# EAGLE design Caja_Navidad (EAGLE 9.6.2)
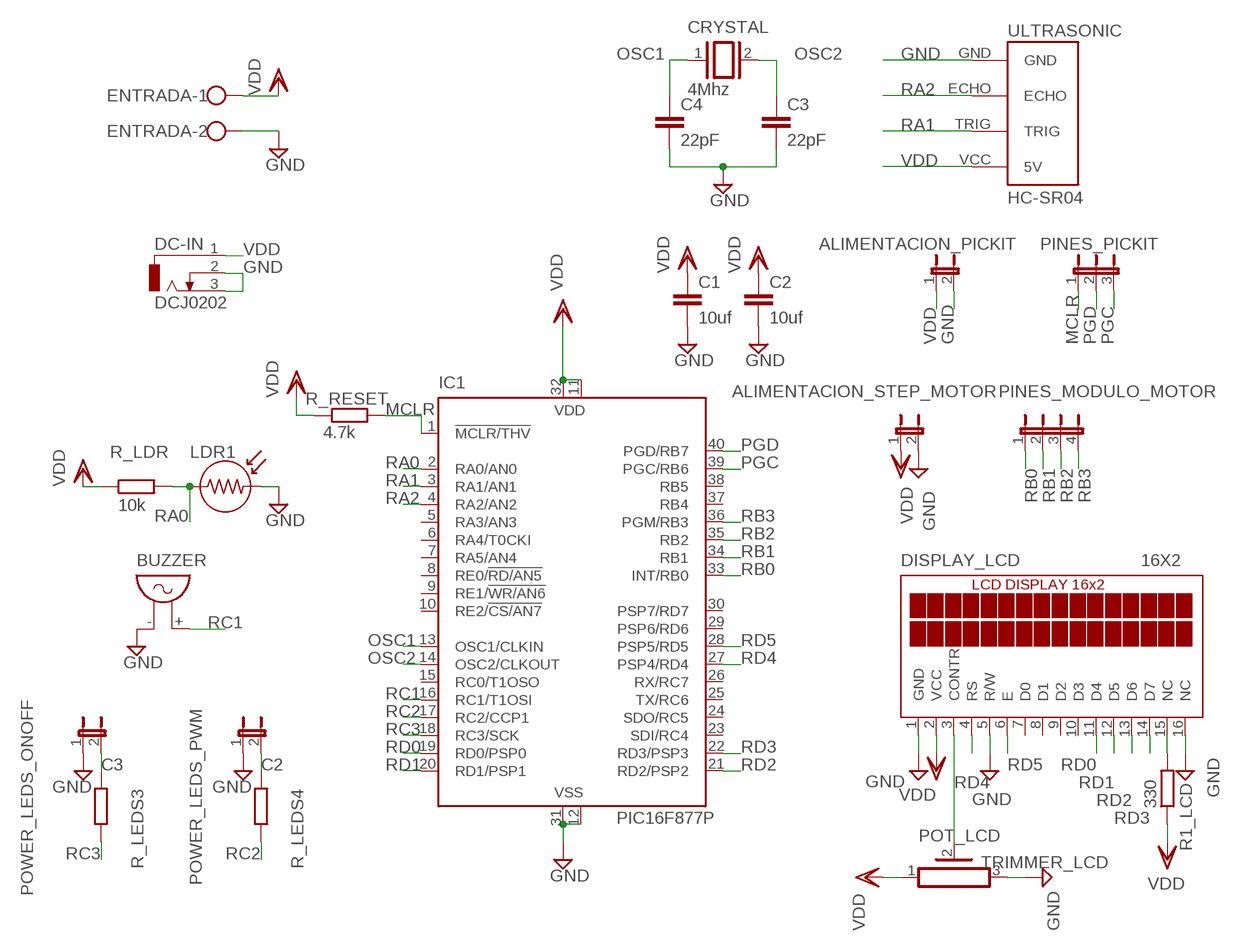
[diagram p0: schematic, sheet 1]

## Parts
ALIMENTACION_PICKIT  JP1E  [JP1]
ALIMENTACION_STEP_MOTOR  JP1E  [JP1]
BUZZER  F/QMX  [F/QMX]
C1  10uf  C2.5/2  [C2.5-2]
C2  10uf  C2.5/2  [C2.5-2]
C3  22pF  C2.5/2  [C2.5-2]
C4  22pF  C2.5/2  [C2.5-2]
CRYSTAL  4Mhz  XTAL  [Q]
DC-IN  DCJ0202  [DCJ0202]
DISPLAY_LCD  16X2  TUXGR_16X2_R2  [TUXGR_16X2_R2]
ENTRADA  W237-102  [W237-102]
IC1  PIC16F877P  [DIL40]
LDR1  LDR  [LDR]
PINES_MODULO_MOTOR  JP4E  [JP4]
PINES_PICKIT  JP2E  [JP2]
POWER_LEDS_ONOFF  JP1E  [JP1]
POWER_LEDS_PWM  JP1E  [JP1]
R1_LCD  330  R-EU_0204/7  [0204/7]
R_LDR  10k  R-EU_0204/7  [0204/7]
R_LEDS3  330  R-EU_0204/7  [0204/7]
R_LEDS4  R-EU_0204/7  [0204/7]
R_RESET  4.7k  R-EU_0204/7  [0204/7]
TRIMMER_LCD  PV36W  [PV36W]
ULTRASONIC  HC-SR04  [HC-SR04_FOOTPRINT]

## Nets
C2: POWER_LEDS_PWM.2 R_LEDS4.2
C3: POWER_LEDS_ONOFF.2 R_LEDS3.2
GND: ALIMENTACION_PICKIT.2 ALIMENTACION_STEP_MOTOR.2 BUZZER.- C1.2 C2.2 C3.2 C4.2 DC-IN.2 DC-IN.3 DISPLAY_LCD.1(GND) DISPLAY_LCD.5(R/W) DISPLAY_LCD.16(NC) ENTRADA.2 IC1.12(VSS) IC1.31(VSS) LDR1.2 POWER_LEDS_ONOFF.1 POWER_LEDS_PWM.1 TRIMMER_LCD.3 ULTRASONIC.GND
MCLR: IC1.1(!MCLR/THV) PINES_PICKIT.1 R_RESET.2
N$2: DISPLAY_LCD.15(NC) R1_LCD.2
OSC1: C4.1 CRYSTAL.1 IC1.13(OSC1/CLKIN)
OSC2: C3.1 CRYSTAL.2 IC1.14(OSC2/CLKOUT)
PGC: IC1.39(PGC/RB6) PINES_PICKIT.3
PGD: IC1.40(PGD/RB7) PINES_PICKIT.2
POT_LCD: DISPLAY_LCD.3(CONTR) TRIMMER_LCD.2
RA0: IC1.2(RA0/AN0) LDR1.1 R_LDR.2
RA1: IC1.3(RA1/AN1) ULTRASONIC.TRIG
RA2: IC1.4(RA2/AN2) ULTRASONIC.ECHO
RB0: IC1.33(INT/RB0) PINES_MODULO_MOTOR.1
RB1: IC1.34(RB1) PINES_MODULO_MOTOR.2
RB2: IC1.35(RB2) PINES_MODULO_MOTOR.3
RB3: IC1.36(PGM/RB3) PINES_MODULO_MOTOR.4
RC1: BUZZER.+ IC1.16(RC1/T1OSI)
RC2: IC1.17(RC2/CCP1) R_LEDS4.1
RC3: IC1.18(RC3/SCK) R_LEDS3.1
RD0: DISPLAY_LCD.11(D4) IC1.19(RD0/PSP0)
RD1: DISPLAY_LCD.12(D5) IC1.20(RD1/PSP1)
RD2: DISPLAY_LCD.13(D6) IC1.21(RD2/PSP2)
RD3: DISPLAY_LCD.14(D7) IC1.22(RD3/PSP3)
RD4: DISPLAY_LCD.4(RS) IC1.27(PSP4/RD4)
RD5: DISPLAY_LCD.6(E) IC1.28(PSP5/RD5)
VDD: ALIMENTACION_PICKIT.1 ALIMENTACION_STEP_MOTOR.1 C1.1 C2.1 DC-IN.1 DISPLAY_LCD.2(VCC) ENTRADA.1 IC1.11(VDD) IC1.32(VDD) R1_LCD.1 R_LDR.1 R_RESET.1 TRIMMER_LCD.1 ULTRASONIC.VCC(5V)
Unconnected: DISPLAY_LCD.7(D0) DISPLAY_LCD.8(D1) DISPLAY_LCD.9(D2) DISPLAY_LCD.10(D3) IC1.5(RA3/AN3) IC1.6(RA4/T0CKI) IC1.7(RA5/AN4) IC1.8(RE0/!RD/AN5) IC1.9(RE1/!WR/AN6) IC1.10(RE2/!CS/AN7) IC1.15(RC0/T1OSO) IC1.23(SDI/RC4) IC1.24(SDO/RC5) IC1.25(TX/RC6) IC1.26(RX/RC7) IC1.29(PSP6/RD6) IC1.30(PSP7/RD7) IC1.37(RB4) IC1.38(RB5)

## Library data of the parts
ALIMENTACION_PICKIT ALIMENTACION_STEP_MOTOR POWER_LEDS_ONOFF POWER_LEDS_PWM = jumper:JP1E: JUMPER
BUZZER = buzzer:F/QMX: BUZZER Source: Buerklin; OC_FARNELL: unknown; OC_NEWARK: unknown
C1-C4 = capacitor-wima:C: CAPACITOR naming: grid - package width
CRYSTAL = special:XTAL: CRYSTAL
DC-IN = con-jack:DCJ0202: DC POWER JACK Source: DCJ0202.pdf; OC_FARNELL: unknown; OC_NEWARK: unknown
DISPLAY_LCD = display-lcd:TUXGR_16X2_R2: Tuxgraphics LCD display 16x2 characters reflective, without background light Source: tuxgr_12x2_r2.pdf; OC_FARNELL: unknown; OC_NEWARK: unknown; SPICEPREFIX: X
ENTRADA = con-wago-500:W237-102: WAGO SCREW CLAMP; MPN: 237-102; OC_FARNELL: unknown; OC_NEWARK: 70K9898
IC1 = microchip:PIC16F87*: MICROCONTROLLER; MF: MICROCHIP; MPN: PIC16F877-04/P; OC_FARNELL: 9761349; OC_NEWARK: 61K3463
LDR1 = MCE_Sensores:LDR: Fotoresistencia
PINES_MODULO_MOTOR = jumper:JP4E: JUMPER
PINES_PICKIT = jumper:JP2E: JUMPER
R1_LCD R_LDR R_LEDS3 R_LEDS4 R_RESET = rcl:R-EU_: RESISTOR, European symbol; SPICEPREFIX: R
TRIMMER_LCD = Resistor:PV36: Rectangular Trimmer Potentiometers - PV36 Series Datasheet <https://www.bourns.com/docs/Product-Datasheets/pv36.pdf>; CATEGORY: Resistor; DESCRIPTION: Lead Sealed Type Multiturn PV36 Series; MANUFACTURER: BOURNS; MPN: PV36W; OPERATING_TEMPERATURE: -55 to +125 °C; PART_STATUS: Active; ROHS_COMPLIANCE: RoHS Compliant; SERIES: PV36; SUB-CATEGORY: Trimpot; TYPE: Lead Sealed
ULTRASONIC = Ultrasonic Sensor HC-SR04:HC-SR04: Ultrasonic Sensor HC-SR04

## Board
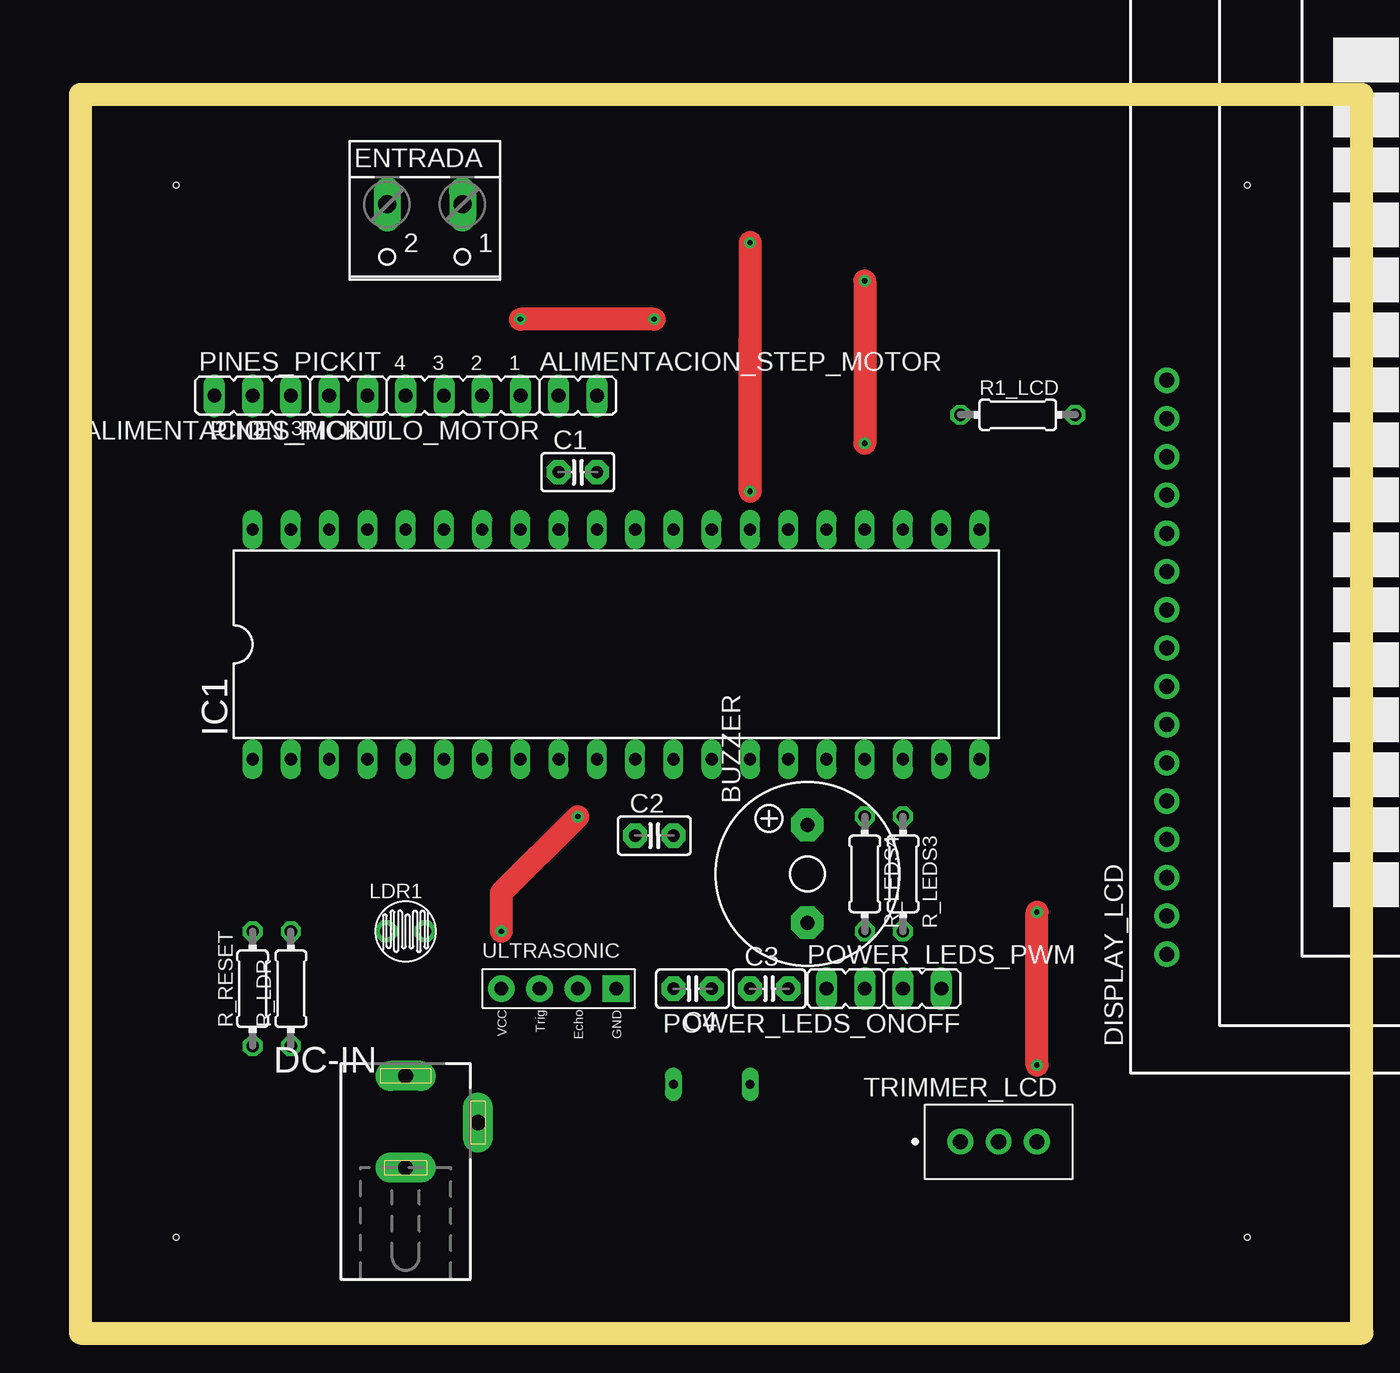
[diagram p1: board, top side]
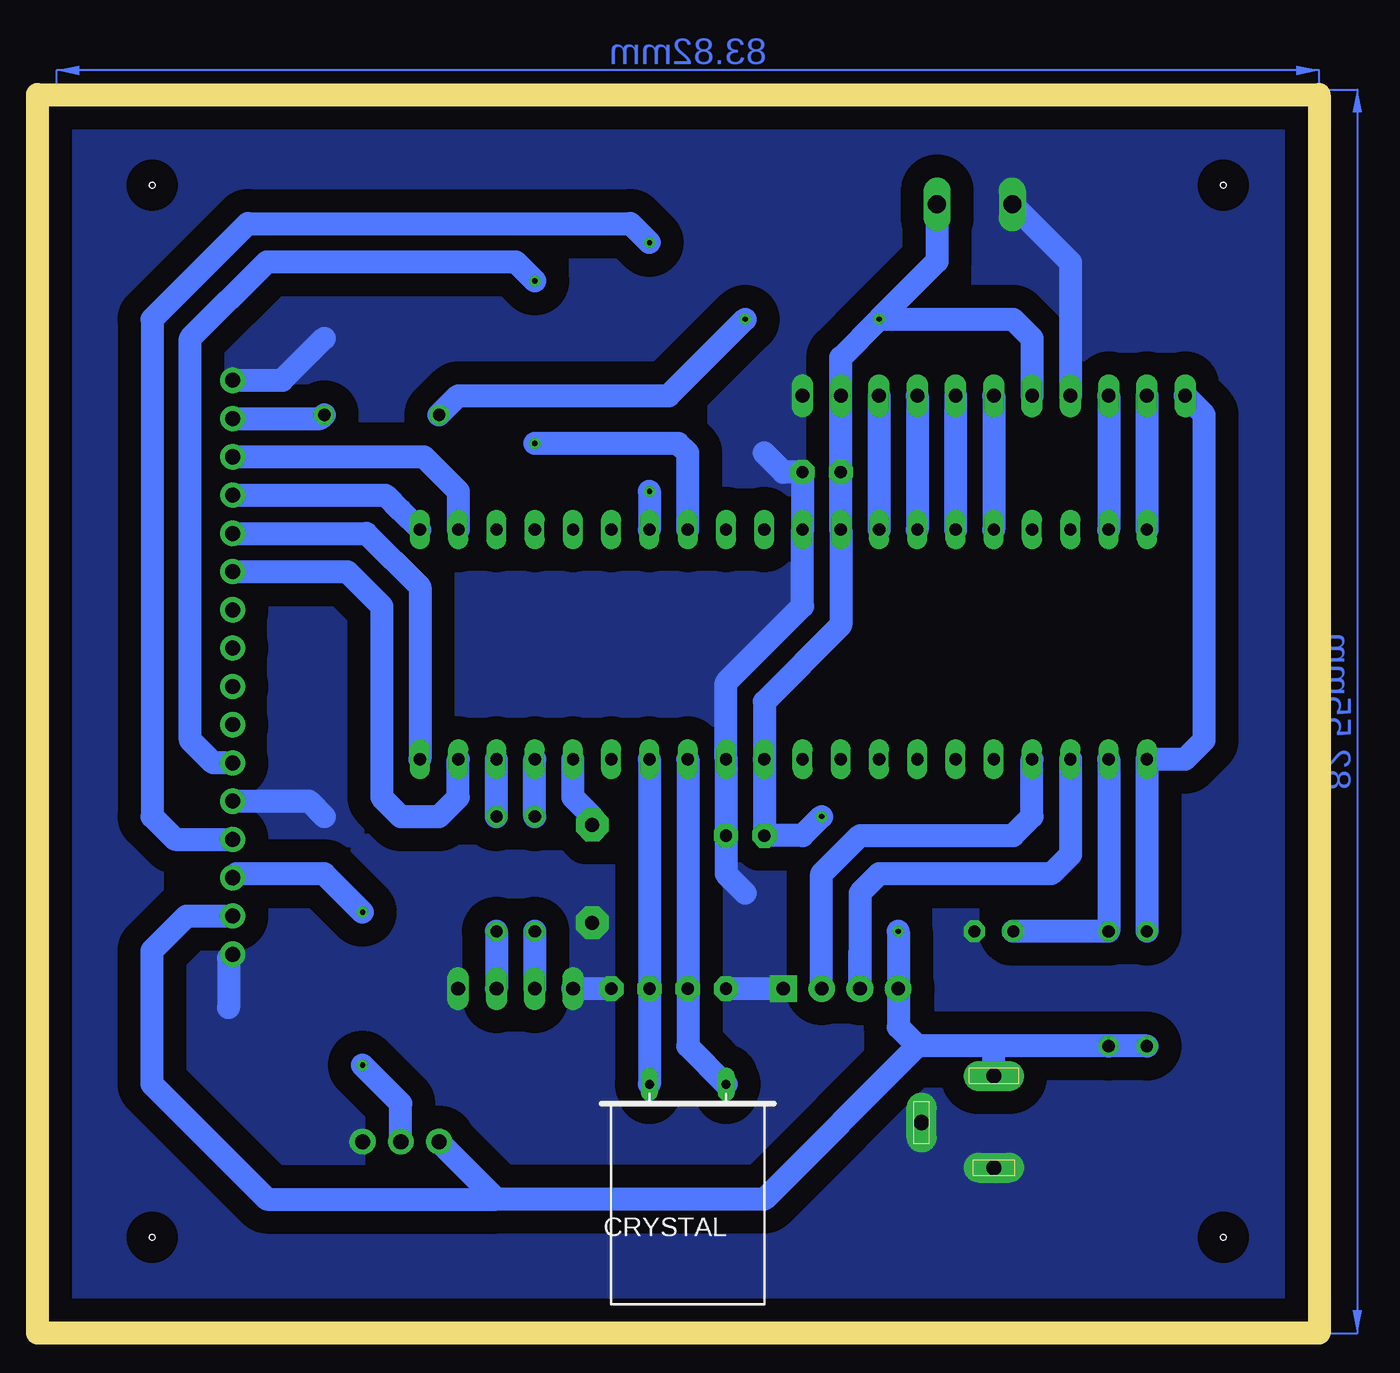
[diagram p2: board, bottom side, seen from below]

Size 85.07 x 82.22 mm. Coordinates in mm from the lower left corner, seen from the top.
Outline: 0,0 85.07,0 85.07,82.22 0,82.22 0,0
Copper layers (1*16): Top 0.035mm / dielectric 1.5mm / Bottom 0.035mm
Design rules "default": minimum track width 6mil, minimum drill 0.35mm, track to track 6mil, track to pad 6mil, pad to pad 6mil, via to via 6mil, smd to smd 6mil, copper to edge 40mil, drill to drill 6mil, minimum pad ring 10mil, minimum via ring 8mil, stop-mask expansion 4mil, vias tented up to drill 0mil, thermal gap 10mil
Holes 0.35 mm at 6.35,76.2 6.35,6.35 77.47,6.35 77.47,76.2

### Footprints (pad centres in the part's own frame; a part is rotated, then mirrored left to right if it is on the bottom)
JP1 = drill 0.914 long: 1 0,-1.27; 2 0,1.27
F/QMX = drill 0.914 pad 2.159 octagon: + 3.251,0; - -3.251,0
C2.5-2 = drill 0.813 pad 1.6 octagon: 1 -1.27,0; 2 1.27,0
Q = drill 0.61 long: 1 -2.54,-7.62; 2 2.54,-7.62
DCJ0202 = drill 1 pad 2 long: 1 0,3.1; 2 4.8,0; 3 0,-3
TUXGR_16X2_R2 = drill 1 pad 1.676: 1 -32,15.5; 2 -29.46,15.5; 3 -26.92,15.5; 4 -24.38,15.5; 5 -21.84,15.5; 6 -19.3,15.5; 7 -16.76,15.5; 8 -14.22,15.5; 9 -11.68,15.5; 10 -9.14,15.5; 11 -6.6,15.5; 12 -4.06,15.5; 13 -1.52,15.5; 14 1.02,15.5; 15 3.56,15.5; 16 6.1,15.5
W237-102 = drill 1.194 long: 1 -2.5,-1.27; 2 2.5,-1.27
DIL40 = drill 0.813 long: 1 -24.13,-7.62; 2 -21.59,-7.62; 3 -19.05,-7.62; 4 -16.51,-7.62; 5 -13.97,-7.62; 6 -11.43,-7.62; 7 -8.89,-7.62; 8 -6.35,-7.62; 9 -3.81,-7.62; 10 -1.27,-7.62; 11 1.27,-7.62; 12 3.81,-7.62; 13 6.35,-7.62; 14 8.89,-7.62; 15 11.43,-7.62; 16 13.97,-7.62; 17 16.51,-7.62; 18 19.05,-7.62; 19 21.59,-7.62; 20 24.13,-7.62; 21 24.13,7.62; 22 21.59,7.62; 23 19.05,7.62; 24 16.51,7.62; 25 13.97,7.62; 26 11.43,7.62; 27 8.89,7.62; 28 6.35,7.62; 29 3.81,7.62; 30 1.27,7.62; 31 -1.27,7.62; 32 -3.81,7.62; 33 -6.35,7.62; 34 -8.89,7.62; 35 -11.43,7.62; 36 -13.97,7.62; 37 -16.51,7.62; 38 -19.05,7.62; 39 -21.59,7.62; 40 -24.13,7.62
LDR = drill 0.813 pad 1.422 octagon: 1 -1.29,0; 2 1.29,0
JP4 = drill 0.914 long: 1 -3.81,0; 2 -1.27,0; 3 1.27,0; 4 3.81,0
JP2 = drill 0.914 long: 1 -2.54,0; 2 0,0; 3 2.54,0
0204/7 = drill 0.813 octagon: 1 -3.81,0; 2 3.81,0
PV36W = drill 1 pad 1.7: 1 0,0; 2 2.54,0; 3 5.08,0
HC-SR04_FOOTPRINT = drill 0.9 pad 1.778: ECHO 0,1.27; TRIG 0,-1.27; VCC 0,-3.81 | drill 0.9 pad 1.778 square: GND 0,3.81

### Placement (x,y rotation side)
ALIMENTACION_PICKIT  17.78,62.23 90 top
ALIMENTACION_STEP_MOTOR  33.02,62.23 270 top
BUZZER  48.26,30.48 90 top
C1  33.02,57.15 0 top
C2  38.1,33.02 0 top
C3  45.72,22.86 0 top
C4  40.64,22.86 180 top
CRYSTAL  41.91,8.89 180 bottom
DC-IN  21.59,13.97 0 top
DISPLAY_LCD  87.63,57.15 90 top
ENTRADA  22.86,73.66 180 top
IC1  35.56,45.72 0 top
LDR1  21.59,26.67 0 top
PINES_MODULO_MOTOR  25.4,62.23 180 top
PINES_PICKIT  11.43,62.23 0 top
POWER_LEDS_ONOFF  55.88,22.86 90 top
POWER_LEDS_PWM  50.8,22.86 270 top
R1_LCD  62.23,60.96 0 top
R_LDR  13.97,22.86 90 top
R_LEDS3  54.61,30.48 270 top
R_LEDS4  52.07,30.48 270 top
R_RESET  11.43,22.86 90 top
TRIMMER_LCD  58.42,12.7 0 top
ULTRASONIC  31.75,22.86 270 top

### Tracks (layer width: path | path; a pad name or v marks a point on that pad's centre or on a via)
C2
  Bottom 1.524: R_LEDS4.2 POWER_LEDS_PWM.2
C3
  Bottom 1.524: R_LEDS3.2 POWER_LEDS_ONOFF.2
GND
  Bottom 1.524: ULTRASONIC.GND C4.2 | DISPLAY_LCD.1 72.39,24.89 72.39,21.59 | DISPLAY_LCD.16 68.83,63.25 66.04,66.04 | 36.83,58.42 35.56,57.15 C1.2 IC1.31 34.29,48.26 39.37,43.18 IC1.12 C2.2 39.37,30.48 38.1,29.21 | ENTRADA.2 16.51,71.08 ALIMENTACION_PICKIT.2 | 66.04,34.29 67.06,35.31 DISPLAY_LCD.5 | C3.2 POWER_LEDS_PWM.1
  pour Bottom (isolate 1.524, no thermals): 0,82.55 0,0 85.09,0 85.09,82.55 3.81,82.55 1.27,85.09
MCLR
  Bottom 1.524: R_RESET.2 IC1.1 8.89,38.1 7.62,39.37 7.62,60.96 PINES_PICKIT.1
N$2
  Bottom 1.524: DISPLAY_LCD.15 66.29,60.71 R1_LCD.2
OSC1
  Bottom 1.524: IC1.13 C4.1 41.91,19.05 CRYSTAL.1
OSC2
  Bottom 1.524: IC1.14 C3.1 CRYSTAL.2
PGC
  Bottom 1.524: PINES_PICKIT.3 IC1.39
PGD
  Bottom 1.524: PINES_PICKIT.2 IC1.40
POT_LCD  (via drill 0.35)
  Top 1.524: v63.5,17.78 v63.5,27.94
  Bottom 1.524: TRIMMER_LCD.2 60.96,15.24 v63.5,17.78 | v63.5,27.94 66.04,30.48 71.88,30.48 DISPLAY_LCD.3
RA0
  Bottom 1.524: IC1.2 R_LDR.2 LDR1.1
RA1
  Bottom 1.524: 30.48,25.4 ULTRASONIC.TRIG 30.48,29.21 29.21,30.48 17.78,30.48 16.51,31.75 IC1.3
RA2
  Bottom 1.524: ULTRASONIC.ECHO 33.02,30.48 30.48,33.02 20.32,33.02 19.05,34.29 IC1.4
RB0
  Bottom 1.524: PINES_MODULO_MOTOR.1 IC1.33
RB1
  Bottom 1.524: PINES_MODULO_MOTOR.2 IC1.34
RB2
  Bottom 1.524: PINES_MODULO_MOTOR.3 IC1.35
RB3
  Bottom 1.524: PINES_MODULO_MOTOR.4 IC1.36
RC1
  Bottom 1.524: BUZZER.+ 48.26,34.29 49.53,35.56 IC1.16
RC2
  Bottom 1.524: R_LEDS4.1 IC1.17
RC3
  Bottom 1.524: R_LEDS3.1 IC1.18
RD0
  Bottom 1.524: DISPLAY_LCD.11 64.52,50.55 62.23,48.26 62.23,35.56 60.96,34.29 58.42,34.29 57.15,35.56 IC1.19
RD1
  Bottom 1.524: DISPLAY_LCD.12 63.25,53.09 59.69,49.53 IC1.20
RD2
  Bottom 1.524: DISPLAY_LCD.13 61.98,55.63 60.96,54.61 IC1.21
RD3
  Bottom 1.524: DISPLAY_LCD.14 59.44,58.17 57.15,55.88 IC1.22
RD4  (via drill 0.35)
  Top 1.524: 44.45,66.04 v44.45,55.88 v44.45,72.39
  Bottom 1.524: DISPLAY_LCD.4 75.95,32.77 77.47,34.29 77.47,67.31 71.12,73.66 45.72,73.66 v44.45,72.39 | v44.45,55.88 IC1.27
RD5  (via drill 0.35)
  Top 1.524: v52.07,69.85 v52.07,59.06
  Bottom 1.524: v52.07,69.85 53.34,71.12 69.85,71.12 74.93,66.04 74.93,39.37 73.41,37.85 DISPLAY_LCD.6 | v52.07,59.06 42.55,59.06 41.91,58.42 IC1.28
VDD  (via drill 0.35)
  Top 1.524: v38.1,67.31 v29.21,67.31 | v33.02,34.29 27.94,29.21 v27.94,26.67
  Bottom 1.524: 21.59,19.05 R_LDR.1 R_RESET.1 | 21.59,19.05 26.67,19.05 | DC-IN.1 21.59,19.05 | 26.67,19.05 36.83,8.89 54.61,8.89 | v27.94,26.67 ULTRASONIC.VCC 27.94,20.32 26.67,19.05 | v29.21,67.31 31.75,64.77 ALIMENTACION_STEP_MOTOR.1 C1.1 IC1.32 31.75,46.99 36.83,41.91 IC1.11 C2.1 34.29,33.02 v33.02,34.29 | ENTRADA.1 25.36,71.16 v29.21,67.31 | v38.1,67.31 43.18,62.23 57.15,62.23 R1_LCD.1 | DISPLAY_LCD.2 75.18,27.69 77.47,25.4 77.47,16.51 69.85,8.89 54.61,8.89 | 54.61,8.89 TRIMMER_LCD.1 | ALIMENTACION_PICKIT.1 19.05,66.04 20.32,67.31 v29.21,67.31
(copper drawn outside any net)
  shapes: Bottom area x2